# EAGLE design bicicletta-battery-sensor (EAGLE 6.1)
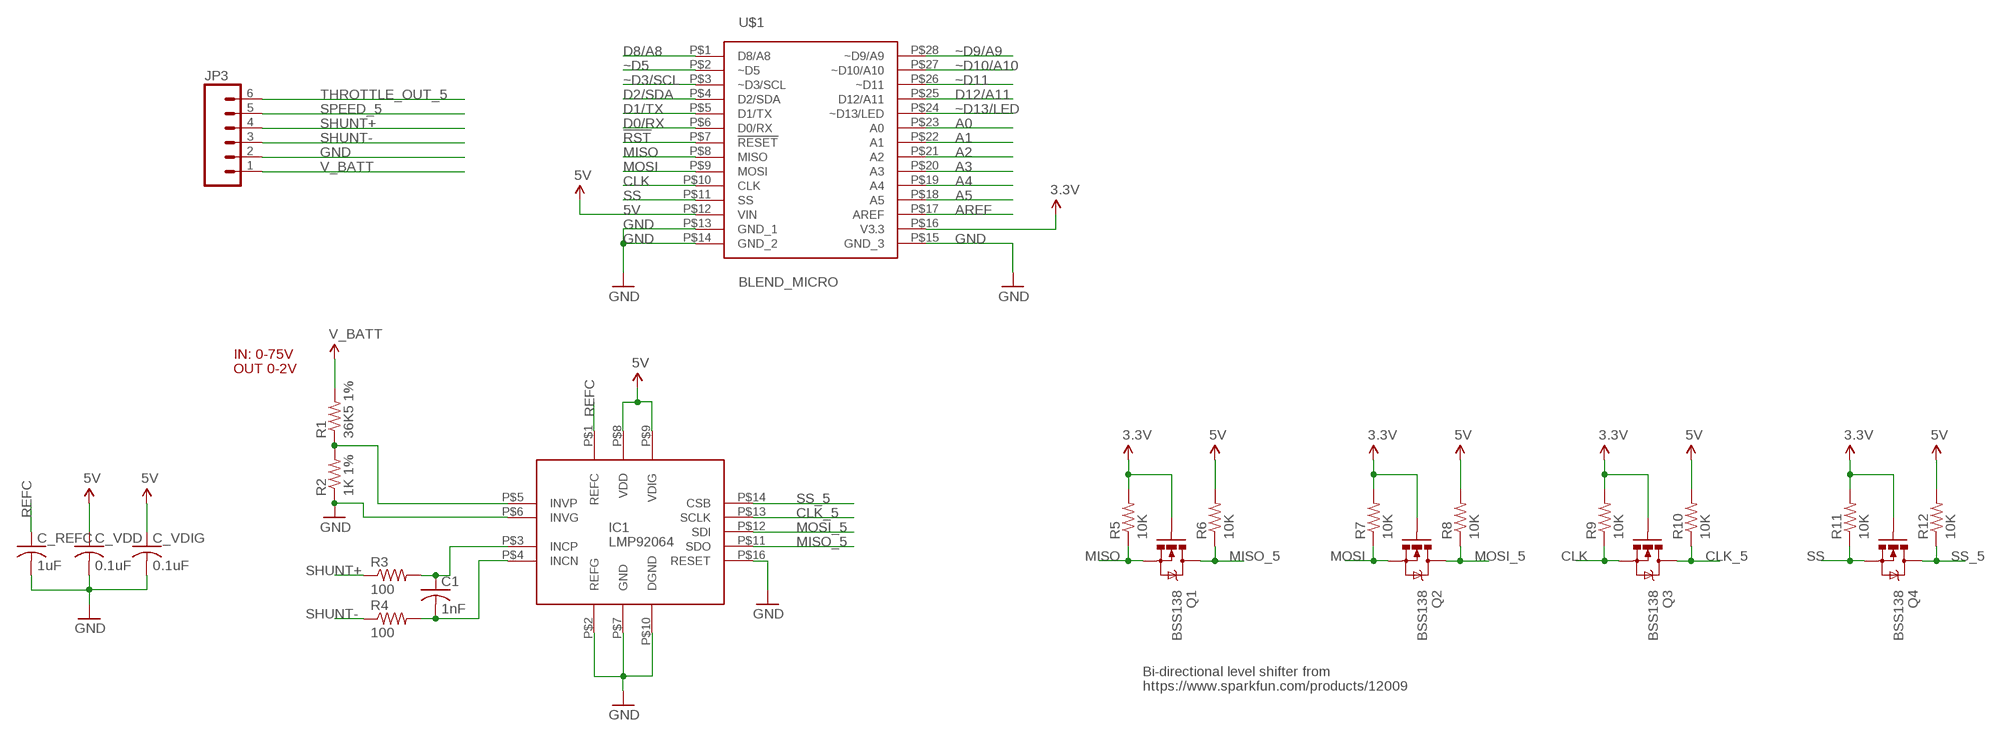
[diagram p0: schematic, sheet 1]

## Parts
C1  1nF  C-USC0603  [C0603]
C_REFC  1uF  C-USC0603  [C0603]
C_VDD  0.1uF  C-USC0603  [C0603]
C_VDIG  0.1uF  C-USC0603  [C0603]
IC1  LMP92064  [WSON-16]
JP3  M06SIP  [1X06]
Q1  BSS138  MOSFET-NCHANNELBSS138  [SOT23-3]
Q2  BSS138  MOSFET-NCHANNELBSS138  [SOT23-3]
Q3  BSS138  MOSFET-NCHANNELBSS138  [SOT23-3]
Q4  BSS138  MOSFET-NCHANNELBSS138  [SOT23-3]
R1  36K5 1%  R-US_R0603  [R0603]
R2  1K 1%  R-US_R0603  [R0603]
R3  100  R-US_R0603  [R0603]
R4  100  R-US_R0603  [R0603]
R5  10K  R-US_R0603  [R0603]
R6  10K  R-US_R0603  [R0603]
R7  10K  R-US_R0603  [R0603]
R8  10K  R-US_R0603  [R0603]
R9  10K  R-US_R0603  [R0603]
R10  10K  R-US_R0603  [R0603]
R11  10K  R-US_R0603  [R0603]
R12  10K  R-US_R0603  [R0603]
U$1  BLEND_MICRO  [BLEND_MICRO]

## Nets
3.3V: Q1.1(G) Q2.1(G) Q3.1(G) Q4.1(G) R5.2 R7.2 R9.2 R11.2 U$1.P$16(V3.3)
5V: C_VDD.1 C_VDIG.1 IC1.P$8(VDD) IC1.P$9(VDIG) R6.2 R8.2 R10.2 R12.2 U$1.P$12(VIN)
!RST: U$1.P$7(!RESET)
A0: U$1.P$23(A0)
A1: U$1.P$22(A1)
A2: U$1.P$21(A2)
A3: U$1.P$20(A3)
A4: U$1.P$19(A4)
A5: U$1.P$18(A5)
AREF: U$1.P$17(AREF)
CLK: Q3.2(S) R9.1 U$1.P$10(CLK)
CLK_5: IC1.P$13(SCLK) Q3.3(D) R10.1
D0/RX: U$1.P$6(D0/RX)
D1/TX: U$1.P$5(D1/TX)
D2/SDA: U$1.P$4(D2/SDA)
D8/A8: U$1.P$1(D8/A8)
D12/A11: U$1.P$25(D12/A11)
GND: C_REFC.2 C_VDD.2 C_VDIG.2 IC1.P$2(REFG) IC1.P$6(INVG) IC1.P$7(GND) IC1.P$10(DGND) IC1.P$16(RESET) JP3.2 R2.1 U$1.P$13(GND_1) U$1.P$14(GND_2) U$1.P$15(GND_3)
MISO: Q1.2(S) R5.1 U$1.P$8(MISO)
MISO_5: IC1.P$11(SDO) Q1.3(D) R6.1
MOSI: Q2.2(S) R7.1 U$1.P$9(MOSI)
MOSI_5: IC1.P$12(SDI) Q2.3(D) R8.1
N$1: IC1.P$5(INVP) R1.1 R2.2
N$3: C1.1 IC1.P$3(INCP) R3.2
N$4: C1.2 IC1.P$4(INCN) R4.2
REFC: C_REFC.1 IC1.P$1(REFC)
SHUNT+: JP3.4 R3.1
SHUNT-: JP3.3 R4.1
SPEED_5: JP3.5
SS: Q4.2(S) R11.1 U$1.P$11(SS)
SS_5: IC1.P$14(CSB) Q4.3(D) R12.1
THROTTLE_OUT_5: JP3.6
V_BATT: JP3.1 R1.2
~D3/SCL: U$1.P$3(~D3/SCL)
~D5: U$1.P$2(~D5)
~D9/A9: U$1.P$28(~D9/A9)
~D10/A10: U$1.P$27(~D10/A10)
~D11: U$1.P$26(~D11)
~D13/LED: U$1.P$24(~D13/LED)

## Notes on the sheet
- IN: 0-75V
- OUT 0-2V
- Bi-directional level shifter from
- https://www.sparkfun.com/products/12009

## Library data of the parts
C1 C_REFC C_VDD C_VDIG = rcl:C-US: CAPACITOR, American symbol
IC1 = Railstars:LMP92064: LMP92064
JP3 = SparkFun-Connectors:M06: Header 6 Standard 6-pin 0.1" header. Use with straight break away headers (SKU : PRT-00116), right angle break away headers (PRT-00553), swiss pins (PRT-00743), machine pins (PRT-00117), and female headers (PRT-00115). Molex polarized connector foot print use with SKU : PRT-08094 with associated crimp pins and housings. NOTES ON THE VARIANTS LOCK and LOCK_LONGPADS... This footprint was designed to help hold the alignment of a through-hole component (i.e. 6-pin header) while soldering it into place. You may notice that each hole has been shifted either up or down by 0.005 of an inch from it's more standard position (which is a perfectly straight line). This slight alteration caused the pins (the squares in the middle) to touch the edges of the holes. Because they are alternating, it causes a "brace" to hold the component in place. 0.005 has proven to be the perfect amount of "off-center" position when using our standard breakaway headers. Although looks a little odd when you look at the bare footprint, once you have a header in there, the alteration is very hard to notice. Also, if you push a header all the way into place, it is covered up entirely on the bottom side. This idea of altering the position of holes to aid alignment will be further integrated into the Sparkfun Library for other footprints. It can help hold any component with 3 or more connection pins.
Q1-Q4 = SparkFun-DiscreteSemi:MOSFET-NCHANNEL: Common NMOSFET Parts MFG P/N Store ID Prod ID FDD8780 TRANS-09984 SI7820DN TRANS-11055 FDS6630A IC-08089 2N7002PW TRANS-11151 FQP30N06L COM-10213 TRANS-10060 BSS123LT1G TRANS-08345 BSS138 TRANS-00830 BS170 2N7000; PROD_ID: TRANS-00830; VALUE: 200mA/50V
R1-R12 = rcl:R-US_: RESISTOR, American symbol
U$1 = Railstars:BLEND_MICRO

## Board
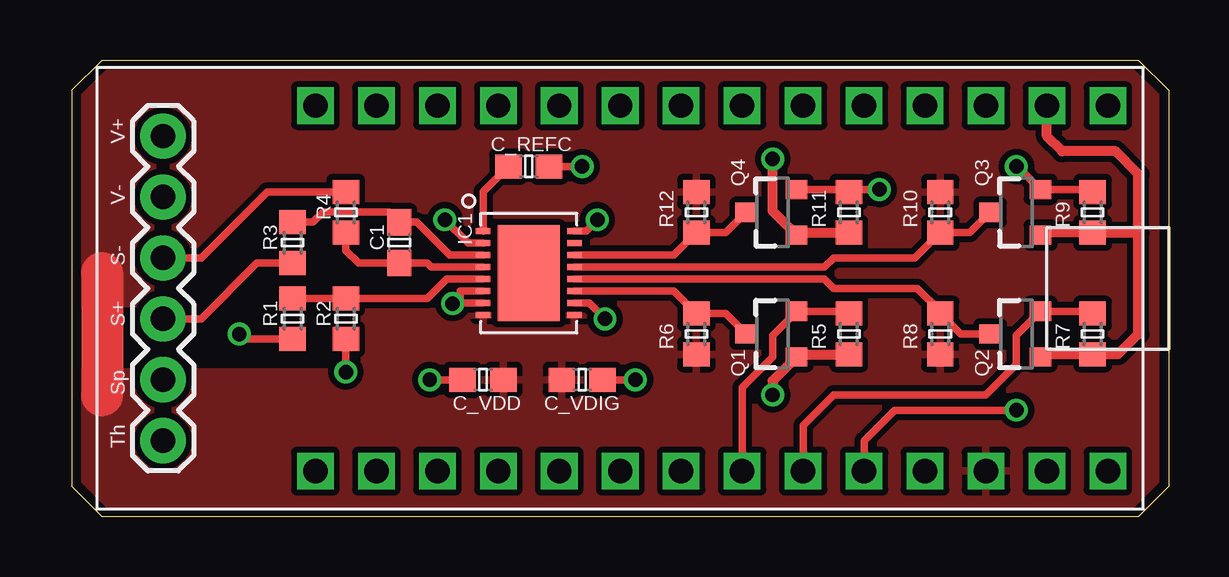
[diagram p1: board, top side]
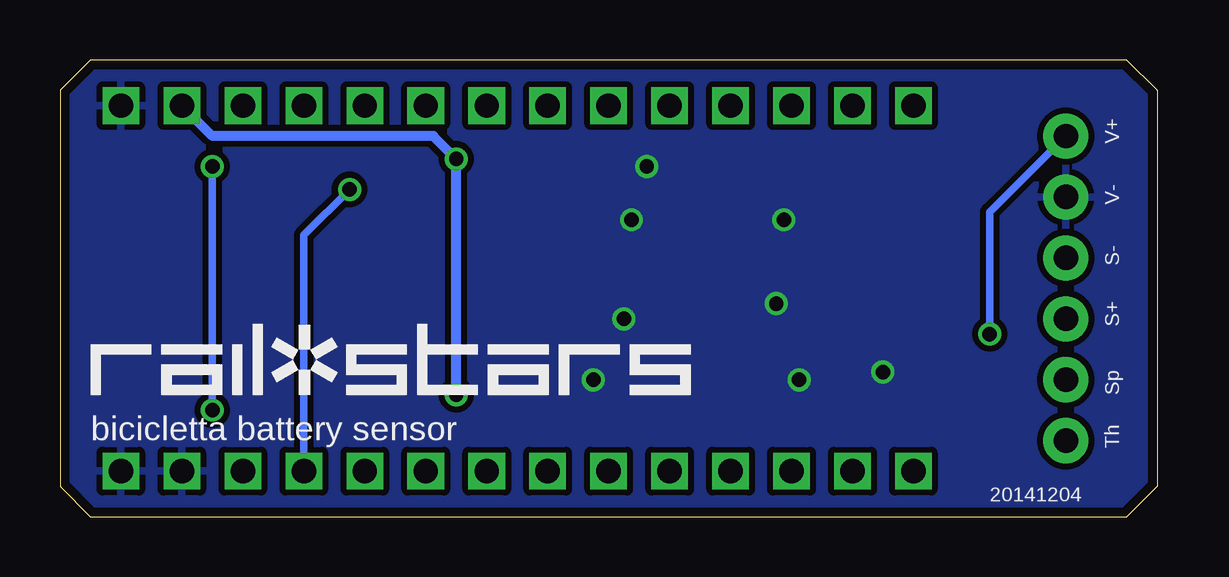
[diagram p2: board, bottom side, seen from below]

Size 45.72 x 19.05 mm. Coordinates in mm from the lower left corner, seen from the top.
Outline: 0,17.78 1.27,19.05 44.45,19.05 45.72,17.78 45.72,1.27 44.45,0 1.27,0 0,1.27 0,17.78
Copper layers (1*16): Top 0.0356mm / dielectric 1.5011mm / Bottom 0.0356mm
Design rules: minimum track width 6mil, minimum drill 13mil, track to track 6mil, track to pad 6mil, pad to pad 6mil, via to via 6mil, smd to smd 6mil, copper to edge 15mil, drill to drill 6mil, minimum pad ring 7mil, minimum via ring 7mil, stop-mask expansion 0mil, vias tented up to drill 200mil, thermal gap 10mil

### Footprints (pad centres in the part's own frame; a part is rotated, then mirrored left to right if it is on the bottom)
C0603 = smd 1.1 x 1: 1 -0.85,0; 2 0.85,0
WSON-16 = smd 0.6 x 0.25: P$1 -1.9,1.75; P$2 -1.9,1.25; P$3 -1.9,0.75; P$4 -1.9,0.25; P$5 -1.9,-0.25; P$6 -1.9,-0.75; P$7 -1.9,-1.25; P$8 -1.9,-1.75; P$9 1.9,-1.75; P$10 1.9,-1.25; P$11 1.9,-0.75; P$12 1.9,-0.25; P$13 1.9,0.25; P$14 1.9,0.75; P$15 1.9,1.25; P$16 1.9,1.75 | smd 2.6 x 4: P$17 0,0
1X06 = drill 1.016 pad 1.88: 1 0,0; 2 2.54,0; 3 5.08,0; 4 7.62,0; 5 10.16,0; 6 12.7,0
SOT23-3 = smd 0.8 x 0.9: 1 -0.95,-1; 2 0.95,-1; 3 0,1.1
R0603 = smd 1 x 1.1: 1 -0.85,0; 2 0.85,0
BLEND_MICRO = drill 1.016 square: P$1 -7.62,12.7; P$2 -7.62,10.16; P$3 -7.62,7.62; P$4 -7.62,5.08; P$5 -7.62,2.54; P$6 -7.62,0; P$7 -7.62,-2.54; P$8 -7.62,-5.08; P$9 -7.62,-7.62; P$10 -7.62,-10.16; P$11 -7.62,-12.7; P$12 -7.62,-15.24; P$13 -7.62,-17.78; P$14 -7.62,-20.32; P$15 7.62,-20.32; P$16 7.62,-17.78; P$17 7.62,-15.24; P$18 7.62,-12.7; P$19 7.62,-10.16; P$20 7.62,-7.62; P$21 7.62,-5.08; P$22 7.62,-2.54; P$23 7.62,0; P$24 7.62,2.54; P$25 7.62,5.08; P$26 7.62,7.62; P$27 7.62,10.16; P$28 7.62,12.7

### Placement (x,y rotation side)
C1  13.65,11.43 270 top
C_REFC  19.05,14.61 0 top
C_VDD  17.14,5.71 180 top
C_VDIG  21.27,5.71 0 top
IC1  19.05,10.16 0 top
JP3  3.81,15.88 270 top
Q1  29.21,7.62 90 top
Q2  39.37,7.62 90 top
Q3  39.37,12.7 90 top
Q4  29.21,12.7 90 top
R1  9.21,8.26 270 top
R2  11.43,8.26 90 top
R3  9.21,11.43 90 top
R4  11.43,12.7 270 top
R5  32.38,7.62 270 top
R6  26.04,7.62 270 top
R7  42.55,7.62 270 top
R8  36.2,7.62 270 top
R9  42.55,12.7 270 top
R10  36.2,12.7 90 top
R11  32.38,12.7 270 top
R12  26.04,12.7 90 top
U$1  22.86,9.53 90 top
U$2  [RAILSTARS_25MM]  44.45,5.08 0 bottom

### Tracks (layer width: path | path; a pad name or v marks a point on that pad's centre or on a via)
3.3V  (via drill 0.6)
  Top 0.406: 44.45,11.85 44.45,7.62 43.6,6.77 R7.2 40.47,6.77 Q2.1 | 44.45,11.85 44.45,14.29 43.5,15.24 41.27,15.24 40.64,15.88 U$1.P$16 | Q3.1 40.47,11.85 R9.2 44.45,11.85 | v29.21,14.92 29.21,12.75 Q4.1 30.31,11.85 R11.2 | R5.2 30.31,6.77 Q1.1 29.21,5.67 v29.21,5.08
  Bottom 0.406: v29.21,5.08 v29.21,14.92 30.16,15.88 39.37,15.88 U$1.P$16
5V
  Top 1.753: 1.27,10.16 1.27,5.08
  pour Top (isolate 0.254): 45.72,19.05 45.72,0 0,0 0,6.03 10.79,6.03 10.79,8.89 0,8.89 0,19.05
CLK  (via drill 0.6)
  Top 0.305: R9.1 42.45,13.65 Q3.2 39.41,14.61 v39.37,14.61 | U$1.P$10 33.02,3.17 34.29,4.45 v39.37,4.45
  Bottom 0.305: v39.37,14.61 v39.37,4.45
CLK_5
  Top 0.305: IC1.P$13 31.36,10.41 31.75,10.79 35.14,10.79 R10.1 37.42,11.85 Q3.3
GND  (via drill 0.6)
  Top 0.305: IC1.P$6 16.19,9.41 16.19,8.91 | IC1.P$7 16.19,8.91 | R2.1 v11.43,6.03 | 16.19,8.91 15.88,8.91 v15.88,8.89 | C_VDD.2 v14.92,5.71 | C_VDIG.2 v23.5,5.71 | IC1.P$10 21.57,8.91 v22.23,8.26 | 21.59,12.06 v21.91,12.38 21.43,11.91 IC1.P$16 | IC1.P$2 16.53,11.41 v15.56,12.38 | C_REFC.2 v21.27,14.61
  pour Bottom (isolate 0.254): 0,19.05 45.72,19.05 45.72,0 0,0
MISO
  Top 0.305: U$1.P$8 27.94,5.4 29.21,6.67 29.21,7.57 Q1.2 32.28,8.57 R5.1
MISO_5
  Top 0.305: IC1.P$11 25.09,9.41 R6.1 27.26,8.47 Q1.3
MOSI
  Top 0.305: U$1.P$9 30.48,3.81 31.75,5.08 38.1,5.08 39.37,6.35 39.37,7.57 Q2.2 42.45,8.57 R7.1
MOSI_5
  Top 0.305: Q2.3 37.05,7.62 R8.1 36.2,8.57 35.24,9.53 31.75,9.53 31.36,9.91 IC1.P$12
N$1
  Top 0.305: R1.1 R2.2 14.82,9.11 15.62,9.91 IC1.P$5
N$3
  Top 0.305: R3.2 10.06,12.28 10.48,12.7 13.23,12.7 C1.1 14.39,12.28 15.76,10.91 IC1.P$3
N$4
  Top 0.305: IC1.P$4 14.99,10.41 14.82,10.58 C1.2 11.96,10.58 11.43,11.11 R4.2
REFC
  Top 0.305: IC1.P$1 17.15,13.55 C_REFC.1
SHUNT+
  Top 0.305: JP3.4 5.4,8.26 7.72,10.58 R3.1
SHUNT-
  Top 0.305: JP3.3 5.4,10.79 8.15,13.55 R4.1
SS  (via drill 0.6)
  Top 0.305: Q4.2 32.28,13.65 R11.1 32.49,13.65 v33.66,13.65
  Bottom 0.305: v33.66,13.65 35.56,11.75 U$1.P$11
SS_5
  Top 0.305: IC1.P$14 25.09,10.91 R12.1 27.26,11.85 Q4.3
V_BATT  (via drill 0.6)
  Top 0.305: R1.2 7.2,7.41 v6.99,7.62
  Bottom 0.305: v6.99,7.62 6.99,12.7 JP3.1

### Text on the board
tPlace: V+ | V- | S- | S+ | Sp | Th
bPlace: V+ | V- | S- | S+ | Sp | Th | bicicletta battery sensor | 20141204